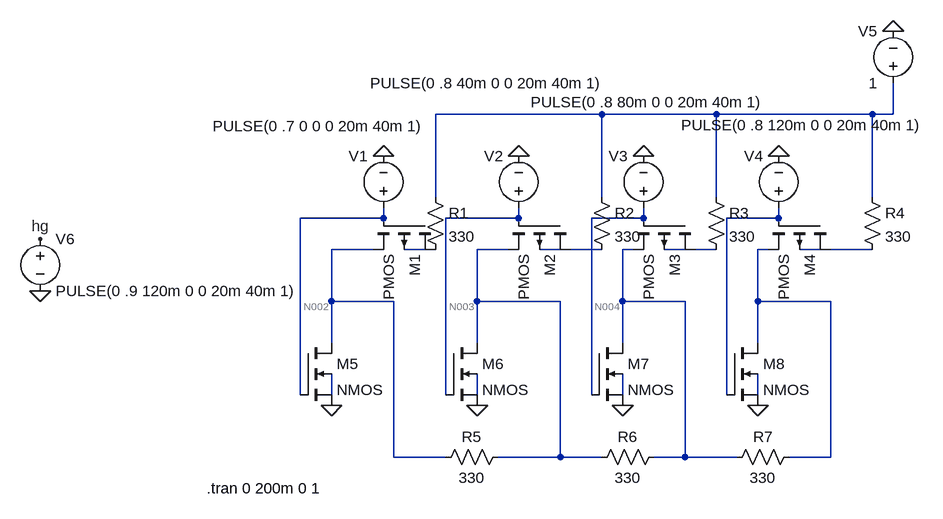
[diagram p0: schematic daisy_chain_pmos4.asc]
daisy_chain_pmos4.asc, the LTspice schematic file:
Version 4
SHEET 1 1092 680
WIRE 464 -48 208 -48
WIRE 640 -48 464 -48
WIRE 880 -48 640 -48
WIRE 912 -48 912 -96
WIRE 912 -48 880 -48
WIRE 208 80 208 -48
WIRE 464 80 464 -48
WIRE 640 80 640 -48
WIRE 880 80 880 -48
WIRE 128 112 128 96
WIRE 128 112 0 112
WIRE 336 112 336 96
WIRE 336 112 224 112
WIRE 528 112 528 96
WIRE 528 112 448 112
WIRE 736 112 736 96
WIRE 736 112 656 112
WIRE 112 160 48 160
WIRE 192 160 160 160
WIRE 320 160 272 160
WIRE 400 160 368 160
WIRE 464 160 416 160
WIRE 512 160 496 160
WIRE 592 160 560 160
WIRE 640 160 608 160
WIRE 720 160 704 160
WIRE 800 160 768 160
WIRE 880 160 816 160
WIRE 48 240 48 160
WIRE 144 240 48 240
WIRE 272 240 272 160
WIRE 400 240 272 240
WIRE 496 240 496 160
WIRE 592 240 496 240
WIRE 704 240 704 160
WIRE 816 240 704 240
WIRE 48 304 48 240
WIRE 272 304 272 240
WIRE 496 304 496 240
WIRE 704 304 704 240
WIRE 0 384 0 112
WIRE 48 384 48 352
WIRE 224 384 224 112
WIRE 272 384 272 352
WIRE 448 384 448 112
WIRE 496 384 496 352
WIRE 656 384 656 112
WIRE 704 384 704 352
WIRE 144 480 144 240
WIRE 224 480 144 480
WIRE 400 480 400 240
WIRE 400 480 304 480
WIRE 464 480 400 480
WIRE 592 480 592 240
WIRE 592 480 544 480
WIRE 672 480 592 480
WIRE 816 480 816 240
WIRE 816 480 752 480
FLAG 48 400 0
FLAG 272 400 0
FLAG 496 400 0
FLAG 704 400 0
FLAG 128 16 0
FLAG 736 16 0
FLAG 336 16 0
FLAG 528 16 0
FLAG 912 -176 0
FLAG -400 224 0
FLAG -400 144 hg
SYMBOL pmos4 208 112 R90
SYMATTR InstName M1
SYMBOL pmos4 416 112 R90
SYMATTR InstName M2
SYMBOL pmos4 608 112 R90
SYMATTR InstName M3
SYMBOL pmos4 816 112 R90
SYMATTR InstName M4
SYMBOL nmos4 0 304 R0
SYMATTR InstName M5
SYMBOL nmos4 224 304 R0
SYMATTR InstName M6
SYMBOL nmos4 448 304 R0
SYMATTR InstName M7
SYMBOL nmos4 656 304 R0
SYMATTR InstName M8
SYMBOL voltage 128 112 R180
WINDOW 0 24 96 Left 2
WINDOW 3 -61 142 Left 2
WINDOW 123 0 0 Left 0
WINDOW 39 0 0 Left 0
SYMATTR InstName V1
SYMATTR Value PULSE(0 .7 0 0 0 20m 40m 1)
SYMBOL voltage 336 112 R180
WINDOW 0 24 96 Left 2
WINDOW 3 -129 208 Left 2
WINDOW 123 0 0 Left 0
WINDOW 39 0 0 Left 0
SYMATTR InstName V2
SYMATTR Value PULSE(0 .8 40m 0 0 20m 40m 1)
SYMBOL voltage 528 112 R180
WINDOW 0 24 96 Left 2
WINDOW 3 -184 179 Left 2
WINDOW 123 0 0 Left 0
WINDOW 39 0 0 Left 0
SYMATTR InstName V3
SYMATTR Value PULSE(0 .8 80m 0 0 20m 40m 1)
SYMBOL voltage 736 112 R180
WINDOW 0 24 96 Left 2
WINDOW 3 -221 143 Left 2
WINDOW 123 0 0 Left 0
WINDOW 39 0 0 Left 0
SYMATTR InstName V4
SYMATTR Value PULSE(0 .8 120m 0 0 20m 40m 1)
SYMBOL voltage 912 -80 R180
WINDOW 0 24 96 Left 2
WINDOW 3 24 16 Left 2
WINDOW 123 0 0 Left 0
WINDOW 39 0 0 Left 0
SYMATTR InstName V5
SYMATTR Value 1
SYMBOL res 192 64 R0
SYMATTR InstName R1
SYMATTR Value 330
SYMBOL res 448 64 R0
SYMATTR InstName R2
SYMATTR Value 330
SYMBOL res 624 64 R0
SYMATTR InstName R3
SYMATTR Value 330
SYMBOL res 864 64 R0
SYMATTR InstName R4
SYMATTR Value 330
SYMBOL voltage -400 128 R0
WINDOW 123 0 0 Left 0
WINDOW 39 0 0 Left 0
SYMATTR InstName V6
SYMATTR Value PULSE(0 .9 120m 0 0 20m 40m 1)
SYMBOL res 320 464 R90
WINDOW 0 0 56 VBottom 2
WINDOW 3 32 56 VTop 2
SYMATTR InstName R5
SYMATTR Value 330
SYMBOL res 560 464 R90
WINDOW 0 0 56 VBottom 2
WINDOW 3 32 56 VTop 2
SYMATTR InstName R6
SYMATTR Value 330
SYMBOL res 768 464 R90
WINDOW 0 0 56 VBottom 2
WINDOW 3 32 56 VTop 2
SYMATTR InstName R7
SYMATTR Value 330
TEXT -144 528 Left 2 !.tran 0 200m 0 1

The netlist it stands for:
* daisy_chain_pmos4.asc
M1 P001 N002 N006 N007 PMOS
M2 N010 N003 N008 N009 PMOS
M3 N013 N004 N011 N012 PMOS
M4 N016 N005 N014 N015 PMOS
M5 N006 N002 0 N017 NMOS
M6 N008 N003 0 N018 NMOS
M7 N011 N004 0 N019 NMOS
M8 N014 N005 0 N020 NMOS
V1 N002 0 PULSE(0 .7 0 0 0 20m 40m 1)
V2 N003 0 PULSE(0 .8 40m 0 0 20m 40m 1)
V3 N004 0 PULSE(0 .8 80m 0 0 20m 40m 1)
V4 N005 0 PULSE(0 .8 120m 0 0 20m 40m 1)
V5 N001 0 1
R1 N001 P001 330
R2 N001 N010 330
R3 N001 N013 330
R4 N001 N016 330
V6 hg 0 PULSE(0 .9 120m 0 0 20m 40m 1)
R5 N008 N006 330
R6 N011 N008 330
R7 N014 N011 330
.model NMOS NMOS
.model PMOS PMOS
.lib standard.mos
.tran 0 200m 0 1
.backanno
.end

* Results of the author's LTspice run, read from the files saved beside the schematic
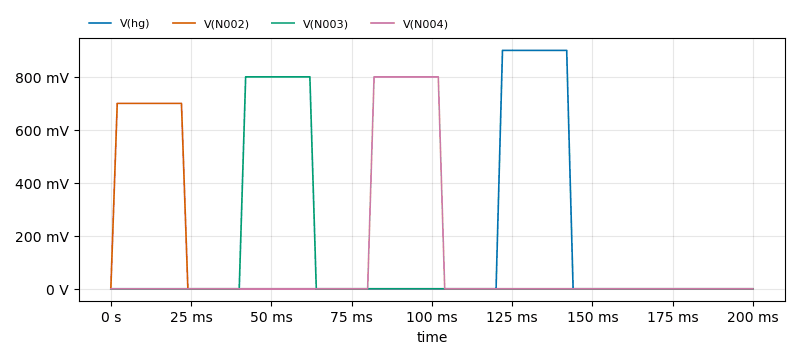
[diagram p1: Transient Analysis of daisy_chain_pmos4.asc, plotted from the saved traces]
* Transient Analysis, 1 run:
*   V(hg): min 0 V, max 900 mV, average 99 mV, rms 294.2 mV, last 0 V
*   V(N002): min 0 V, max 700 mV, average 77 mV, rms 229.1 mV, last 0 V
*   V(N003): min 0 V, max 800 mV, average 88 mV, rms 261.7 mV, last 0 V
*   V(N004): min 0 V, max 800 mV, average 88 mV, rms 261.7 mV, last 0 V